# EAGLE design 2 byte output (EAGLE 9.4.2)
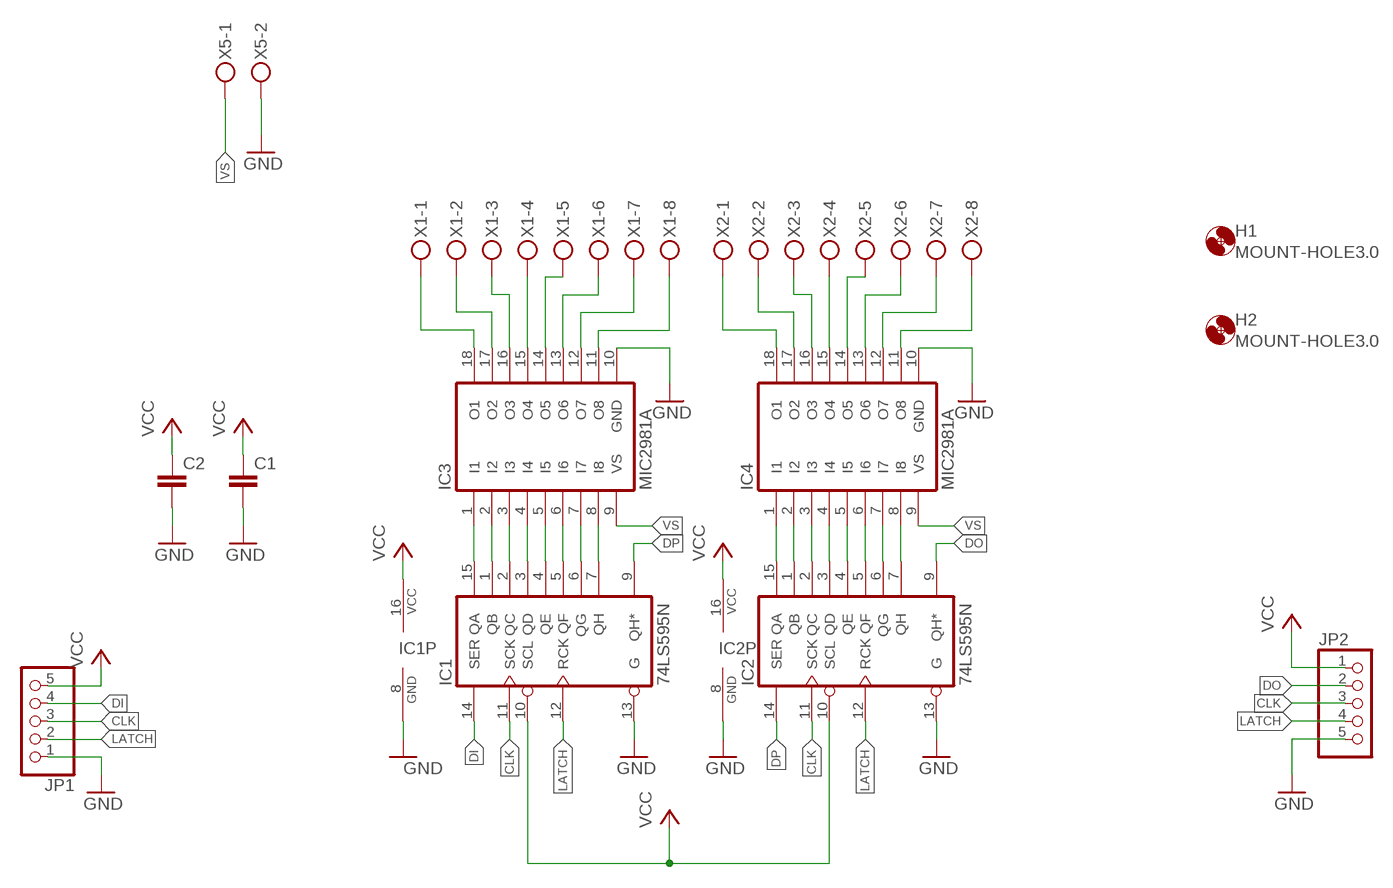
[diagram p0: schematic, sheet 1]

## Parts
C1  C-EU050-035X075  [C050-035X075]
C2  C-EU050-035X075  [C050-035X075]
H1  MOUNT-HOLE3.0  [3,0]
H2  MOUNT-HOLE3.0  [3,0]
IC1  74LS595N  [DIL16]
IC2  74LS595N  [DIL16]
IC3  MIC2981A  UDN2981A  [DIL18]
IC4  MIC2981A  UDN2981A  [DIL18]
JP1  PINHD-1X5/90  [1X05/90]
JP2  PINHD-1X5/90  [1X05/90]
X1  MKDSN1,5/8-5,08  [MKDSN1,5/8-5,08]
X2  MKDSN1,5/8-5,08  [MKDSN1,5/8-5,08]
X5  MKDSN1,5/2-5,08  [MKDSN1,5/2-5,08]

## Nets
CLK: IC1.11(SCK) IC2.11(SCK) JP1.3 JP2.3
DI: IC1.14(SER) JP1.4
DO: IC2.9(QH*) JP2.2
DP: IC1.9(QH*) IC2.14(SER)
GND: C1.2 C2.2 IC1.8(GND) IC1.13(G) IC2.8(GND) IC2.13(G) IC3.10(GND) IC4.10(GND) JP1.1 JP2.5 X5.2
LATCH: IC1.12(RCK) IC2.12(RCK) JP1.2 JP2.4
N$1: IC3.15(O4) X1.4
N$2: IC3.16(O3) X1.3
N$3: IC3.17(O2) X1.2
N$4: IC3.18(O1) X1.1
N$5: IC3.14(O5) X1.5
N$6: IC3.12(O7) X1.7
N$7: IC3.11(O8) X1.8
N$8: IC3.13(O6) X1.6
N$9: IC4.15(O4) X2.4
N$10: IC4.16(O3) X2.3
N$11: IC4.17(O2) X2.2
N$12: IC4.18(O1) X2.1
N$13: IC4.14(O5) X2.5
N$14: IC4.13(O6) X2.6
N$15: IC4.12(O7) X2.7
N$16: IC4.11(O8) X2.8
N$17: IC1.15(QA) IC3.1(I1)
N$18: IC1.1(QB) IC3.2(I2)
N$19: IC1.2(QC) IC3.3(I3)
N$20: IC1.3(QD) IC3.4(I4)
N$21: IC1.4(QE) IC3.5(I5)
N$22: IC1.5(QF) IC3.6(I6)
N$23: IC1.6(QG) IC3.7(I7)
N$24: IC1.7(QH) IC3.8(I8)
N$25: IC2.15(QA) IC4.1(I1)
N$26: IC2.1(QB) IC4.2(I2)
N$27: IC2.2(QC) IC4.3(I3)
N$28: IC2.3(QD) IC4.4(I4)
N$29: IC2.4(QE) IC4.5(I5)
N$30: IC2.5(QF) IC4.6(I6)
N$31: IC2.6(QG) IC4.7(I7)
N$32: IC2.7(QH) IC4.8(I8)
VCC: C1.1 C2.1 IC1.10(SCL) IC1.16(VCC) IC2.10(SCL) IC2.16(VCC) JP1.5 JP2.1
VS: IC3.9(VS) IC4.9(VS) X5.1

## Library data of the parts
C1 C2 = resistor:C-EU: CAPACITOR, European symbol
H1 H2 = holes:MOUNT-HOLE: MOUNTING HOLE with drill center marker
IC1 IC2 = 74xx-us:74*595: 8-bit SHIFT REGISTER, output latch
IC3 IC4 = uln-udn:UDN298*: DRIVER ARRAY Source: Allegro Microsystems Inc. / UDN2981-UDN2984.pdf
JP1 JP2 = pinhead:PINHD-1X5: PIN HEADER
X1 X2 = con-phoenix-508:MKDSN1,5/8-5,08: MKDSN 1,5/ 8-5,08 Printklemme Nennstrom: 13,5 A Nennspannung: 250 V Rastermaß: 5,08 mm Polzahl: 8 Anschlussart: Schraubanschluss Montage: Löten Anschlussrichtung Leiter/Platine: 0 ° Artikelnummer: 1729186 Source: http://eshop.phoenixcontact.com .. 1729186.pdf
X5 = con-phoenix-508:MKDSN1,5/2-5,08: MKDSN 1,5/ 2-5,08 Printklemme Nennstrom: 13,5 A Nennspannung: 250 V Rastermaß: 5,08 mm Polzahl: 2 Anschlussart: Schraubanschluss Montage: Löten Anschlussrichtung Leiter/Platine: 0 ° Artikelnummer: 1729128 Source: http://eshop.phoenixcontact.com .. 1729128.pdf

## Board
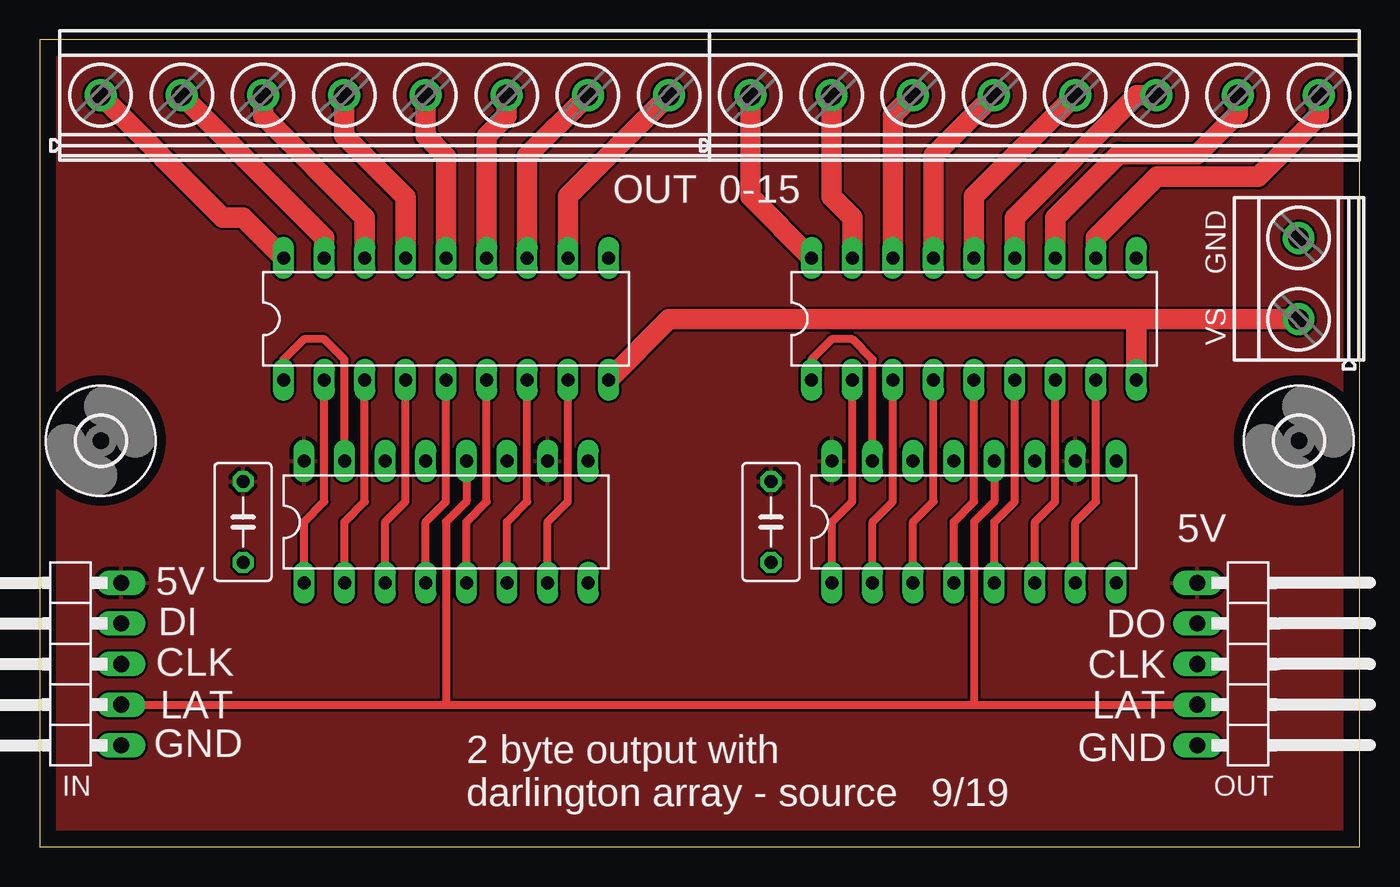
[diagram p1: board, top side]
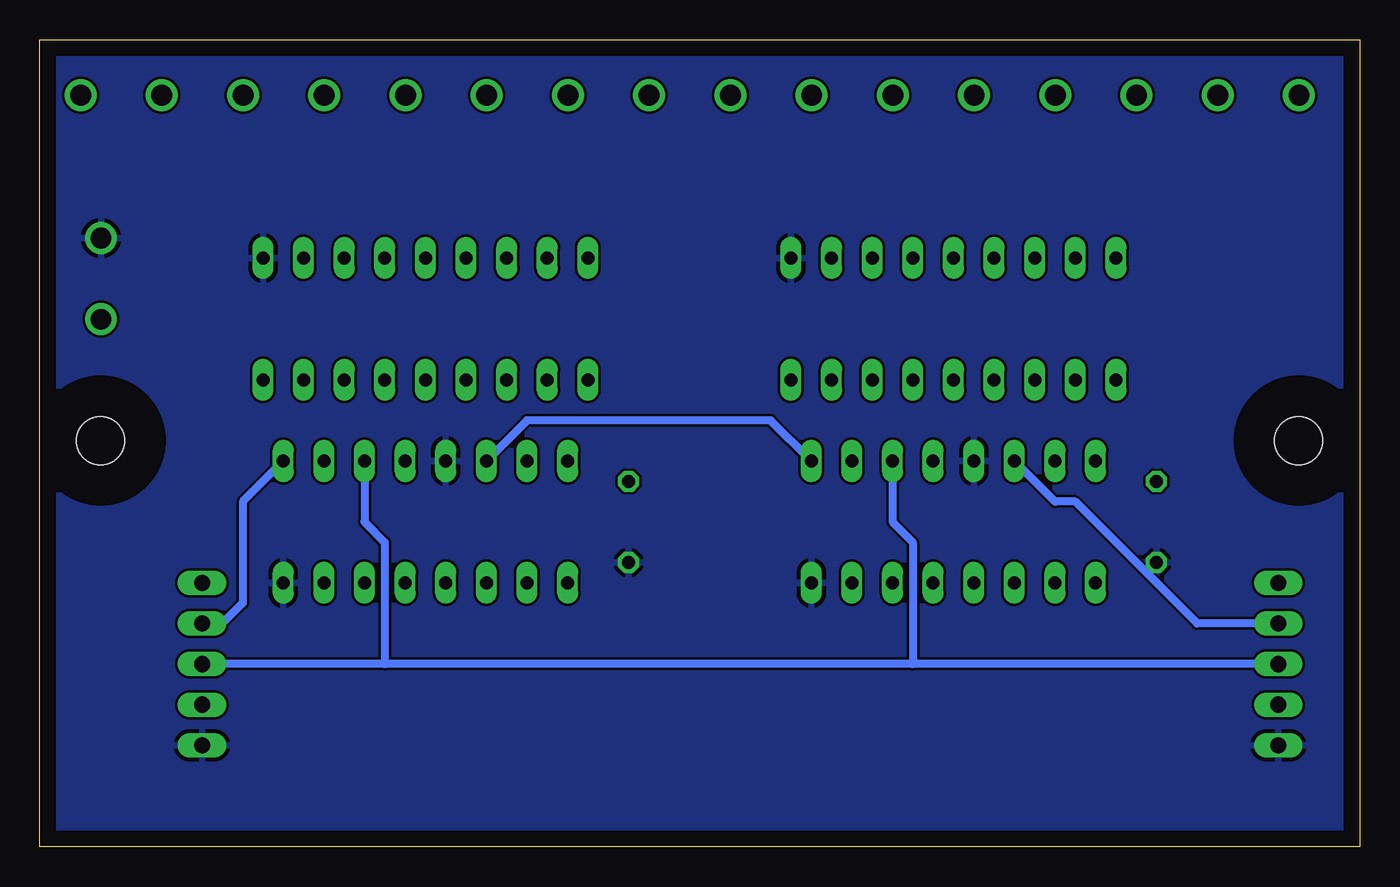
[diagram p2: board, bottom side, seen from below]

Size 82.53 x 50.47 mm. Coordinates in mm from the lower left corner, seen from the top.
Outline: 0,0 82.53,0 82.53,50.47 0,50.47 0,0
Copper layers (1*16): Top 0.035mm / dielectric 1.5mm / Bottom 0.035mm
Design rules "default": minimum track width 6mil, minimum drill 0.35mm, track to track 6mil, track to pad 6mil, pad to pad 6mil, via to via 6mil, smd to smd 6mil, copper to edge 40mil, drill to drill 6mil, minimum pad ring 10mil, minimum via ring 8mil, stop-mask expansion 4mil, vias tented up to drill 0mil, thermal gap 10mil

### Footprints (pad centres in the part's own frame; a part is rotated, then mirrored left to right if it is on the bottom)
C050-035X075 = drill 0.813 octagon: 1 -2.54,0; 2 2.54,0
3,0 = hole 3: 0,0
DIL16 = drill 0.813 long: 1 -8.89,-3.81; 2 -6.35,-3.81; 3 -3.81,-3.81; 4 -1.27,-3.81; 5 1.27,-3.81; 6 3.81,-3.81; 7 6.35,-3.81; 8 8.89,-3.81; 9 8.89,3.81; 10 6.35,3.81; 11 3.81,3.81; 12 1.27,3.81; 13 -1.27,3.81; 14 -3.81,3.81; 15 -6.35,3.81; 16 -8.89,3.81
DIL18 = drill 0.813 long: 1 -10.16,-3.81; 2 -7.62,-3.81; 3 -5.08,-3.81; 4 -2.54,-3.81; 5 0,-3.81; 6 2.54,-3.81; 7 5.08,-3.81; 8 7.62,-3.81; 9 10.16,-3.81; 10 10.16,3.81; 11 7.62,3.81; 12 5.08,3.81; 13 2.54,3.81; 14 0,3.81; 15 -2.54,3.81; 16 -5.08,3.81; 17 -7.62,3.81; 18 -10.16,3.81
1X05/90 = drill 1.016 long: 1 -5.08,-3.81; 2 -2.54,-3.81; 3 0,-3.81; 4 2.54,-3.81; 5 5.08,-3.81
MKDSN1,5/8-5,08 = drill 1.3 pad 2: 1 -17.801,0.025; 2 -12.721,0.025; 3 -7.641,0.025; 4 -2.561,0.025; 5 2.519,0.025; 6 7.599,0.025; 7 12.679,0.025; 8 17.759,0.025
MKDSN1,5/2-5,08 = drill 1.3 pad 2: 1 -2.561,0.025; 2 2.519,0.025

### Placement (x,y rotation side)
C1  12.7,20.32 270 top
C2  45.72,20.32 270 top
H1  3.81,25.4 0 top
H2  78.74,25.4 0 top
IC1  25.4,20.32 0 top
IC2  58.42,20.32 0 top
IC3  25.4,33.02 0 top
IC4  58.42,33.02 0 top
JP1  1.27,11.43 90 top
JP2  76.2,11.43 270 top
X1  21.59,46.99 0 top
X2  62.23,46.99 0 top
X5  78.74,35.56 90 top

### Tracks (layer width: path | path; a pad name or v marks a point on that pad's centre or on a via)
CLK
  Bottom 0.508: JP1.3 27.94,11.43 | 27.94,11.43 60.96,11.43 | 60.96,11.43 JP2.3 | IC2.11 62.23,20.32 60.96,19.05 60.96,11.43 | IC1.11 29.21,20.32 27.94,19.05 27.94,11.43
DI
  Bottom 0.508: JP1.4 10.16,13.97 17.78,21.59 19.05,21.59 IC1.14
DO
  Bottom 0.508: IC2.9 69.85,21.59 69.85,15.24 71.12,13.97 JP2.2
DP
  Bottom 0.508: IC1.9 36.83,26.67 52.07,26.67 IC2.14
GND
  pour Bottom: -3.81,54.61 85.09,54.61 85.09,-2.54 -3.81,-2.54
LATCH
  Top 0.508: JP1.2 25.4,8.89 | 25.4,8.89 58.42,8.89 | 58.42,8.89 JP2.4 | IC2.12 59.69,21.59 58.42,20.32 58.42,8.89 | IC1.12 26.67,21.59 25.4,20.32 25.4,8.89
N$1
  Top 1.27: IC3.15 22.86,40.64 19.03,44.47 X1.4
N$2
  Top 1.27: X1.3 13.95,45.74 20.32,39.37 IC3.16
N$3
  Top 1.27: X1.2 17.78,38.1 IC3.17
N$4
  Top 1.27: IC3.18 12.7,39.37 11.43,39.37 X1.1
N$5
  Top 1.27: X1.5 24.11,44.47 25.4,43.18 IC3.14
N$6
  Top 1.27: IC3.12 30.48,43.23 X1.7
N$7
  Top 1.27: IC3.11 33.02,40.69 X1.8
N$8
  Top 1.27: X1.6 29.19,45.7 27.94,44.45 IC3.13
N$9
  Top 1.27: IC4.15 55.88,43.23 X2.4
N$10
  Top 1.27: IC4.16 53.34,45.77 X2.3
N$11
  Top 1.27: X2.2 49.51,40.66 50.8,39.37 IC4.17
N$12
  Top 1.27: IC4.18 44.43,40.66 X2.1
N$13
  Top 1.27: IC4.14 58.42,40.69 X2.5
N$14
  Top 1.27: IC4.13 60.96,39.37 68.61,47.02 X2.6
N$15
  Top 1.27: IC4.12 63.5,39.37 67.46,43.33 72.39,43.33 74.91,45.85 X2.7
N$16
  Top 1.27: IC4.11 66.04,38.1 69.85,41.91 76.2,41.91 79.99,45.7 X2.8
N$17
  Top 0.508: IC1.15 19.05,30.48 17.78,31.75 16.51,31.75 15.24,30.48 IC3.1
N$18
  Top 0.508: IC1.1 16.51,20.32 17.78,21.59 IC3.2
N$19
  Top 0.508: IC1.2 19.05,20.32 20.32,21.59 IC3.3
N$20
  Top 0.508: IC1.3 21.59,20.32 22.86,21.59 IC3.4
N$21
  Top 0.508: IC1.4 24.13,20.32 25.4,21.59 IC3.5
N$22
  Top 0.508: IC1.5 26.67,20.32 27.94,21.59 IC3.6
N$23
  Top 0.508: IC1.6 29.21,20.32 30.48,21.59 IC3.7
N$24
  Top 0.508: IC1.7 31.75,20.32 33.02,21.59 IC3.8
N$25
  Top 0.508: IC2.15 52.07,30.48 50.8,31.75 49.53,31.75 48.26,30.48 IC4.1
N$26
  Top 0.508: IC2.1 49.53,20.32 50.8,21.59 IC4.2
N$27
  Top 0.508: IC2.2 52.07,20.32 53.34,21.59 IC4.3
N$28
  Top 0.508: IC2.3 54.61,20.32 55.88,21.59 IC4.4
N$29
  Top 0.508: IC2.4 57.15,20.32 58.42,21.59 IC4.5
N$30
  Top 0.508: IC2.5 59.69,20.32 60.96,21.59 IC4.6
N$31
  Top 0.508: IC2.6 62.23,20.32 63.5,21.59 IC4.7
N$32
  Top 0.508: IC2.7 64.77,20.32 66.04,21.59 IC4.8
VCC
  pour Top: -2.54,-3.81 -2.54,58.42 87.63,58.42 87.63,-3.81
VS
  Top 1.27: IC3.9 39.35,33 68.58,33 | 68.58,33 X5.1 | IC4.9 68.58,33

### Text on the board
tNames: OUT 0-15 | GND | VS | 5V | 5V | DI | DO | CLK | CLK | LAT | LAT | GND | GND | IN | 2 byte output with / darlington array - source 9/19 | OUT